# Altium schematic sheet Bluetooth and OLED Display.SchDoc
size A4
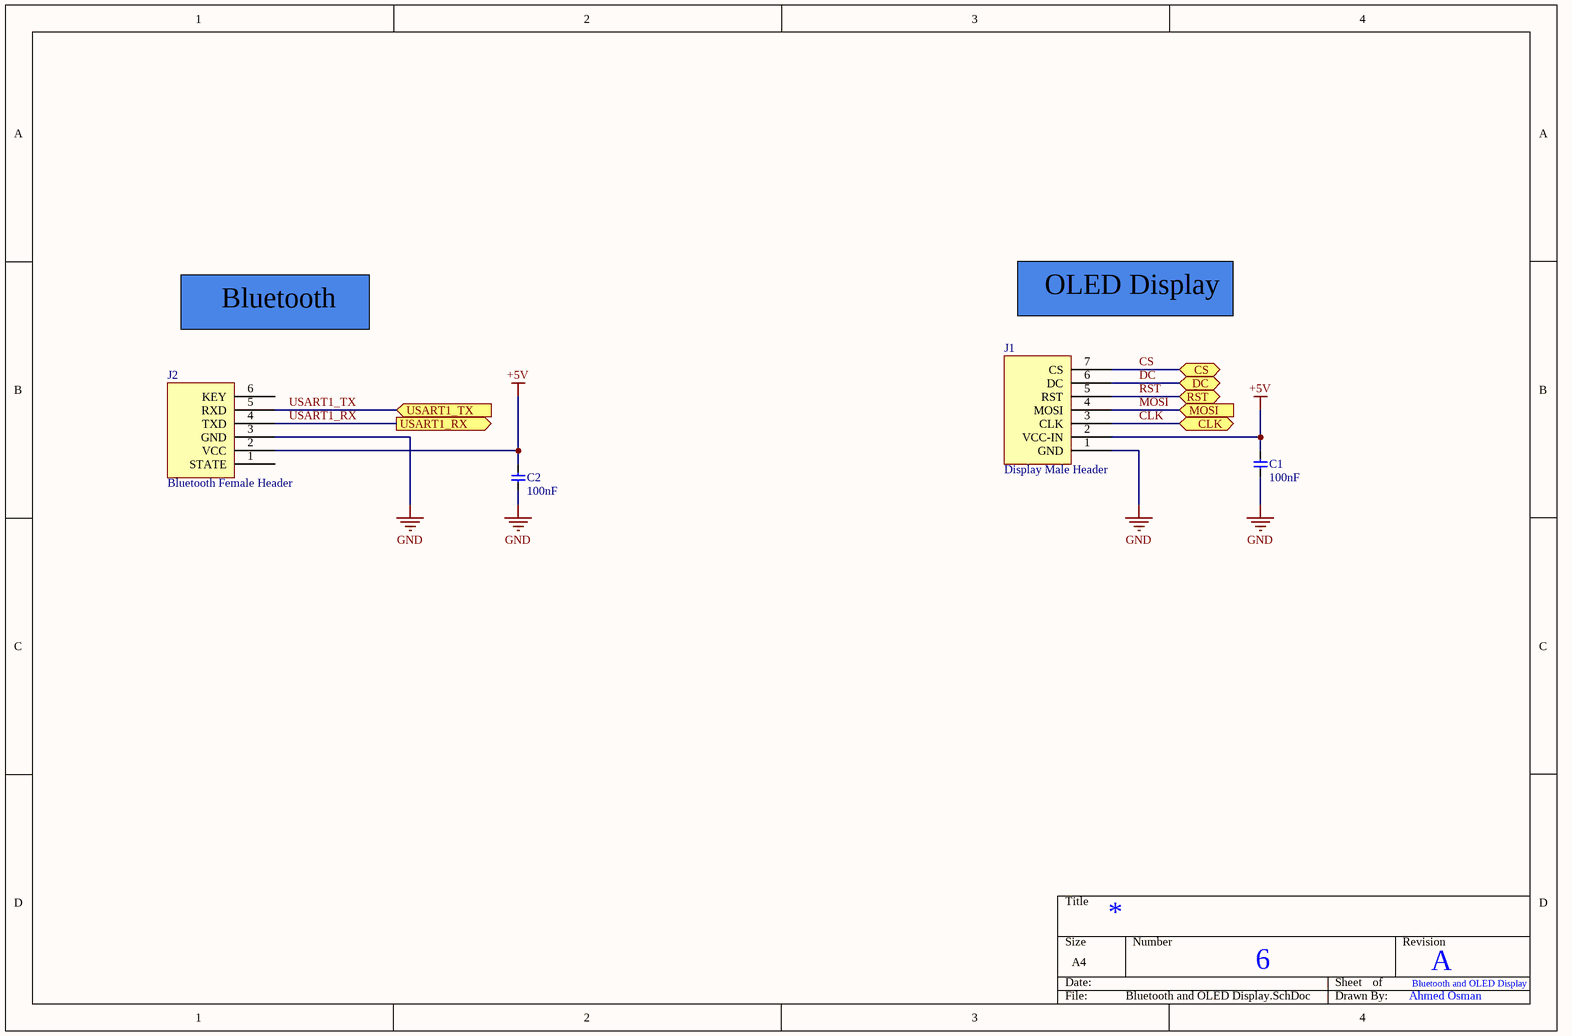
[diagram p0: Bluetooth and OLED Display.SchDoc]

## Parts
C1  100nF  [CAP 0603]
C2  100nF  [CAP 0603]
J1  Display Male Header  [OLED Display]
J2  Bluetooth Female Header  [HC-05 Bluetooth]

## Ports
CLK (bidir), CS (bidir), DC (bidir), MOSI (in), RST (bidir), USART1_RX (out), USART1_TX (in)

## Nets
+5V: C1.2 C2.1 J1.2(VCC-IN) J2.2(VCC)
GND: C1.1 C2.2 J1.1(GND) J2.3(GND)
CLK: J1.3(CLK) ; port CLK
CS: J1.7(CS) ; port CS
DC: J1.6(DC) ; port DC
MOSI: J1.4(MOSI) ; port MOSI
RST: J1.5(RST) ; port RST
USART1_RX: J2.4(TXD) ; port USART1_RX
USART1_TX: J2.5(RXD) ; port USART1_TX

Not connected (* = marked no-connect by the designer): J2 1(STATE) 6(KEY)

## Notes on the sheet
- Bluetooth
- OLED Display
- 6
- Bluetooth and OLED Display
- A
- Ahmed Osman

## Library data of the parts
C1 C2 = CAP  0603 100 nF 10% 50 V: 0.1 µF ±10% 50V Ceramic Capacitor X7R 0603 (1608 Metric); Manufacturer 1: Samsung; Manufacturer Part Number 1: CL10B104KB8NNNC; Supplier 1: Digikey; Stock 1: 6418947; Pricing 1: 4000 = 0.00562, 8000 = 0.00513, 12000 = 0.00489, 28000 = 0.00464, 100000 = 0.00336, 200000 = 0.00325, 400000 = 0.00306 (USD); RoHS: Yes; Mount: Surface Mount; Case/Package: 0603; Case Code (Metric): 1608; Case Code (Imperial): 0603; Material: Ceramic; Min Operating Temperature: -55°C; Max Operating Temperature: 125°C; Capacitance: 100nF; Tolerance: 10%; Dielectric: X7R; Voltage: 50V; Voltage Rating (DC): 50V; Voltage Rating: 50V; Package Quantity: 1; Packaging: Tape and Reel; Series: CL; Construction: Flat; Length: 1.6mm; Width: 0.031inch; Height: 0.8mm; Depth: 0.8mm; Thickness: 0.035inch; Radiation Hardening: No; Lead Free: Lead Free; RoHS Compliant: Yes; ComponentLink1URL: https://datasheet.ciiva.com/25803/cl10b104kb8nnnc-25803393.pdf?src-supplier=Digikey; ComponentLink1Description: https://datasheet.ciiva.com/25803/cl10b104kb8nnnc-25803393.pdf?src-supplier=Digikey; ComponentLink2URL: https://datasheet.ciiva.com/26838/getdatasheetpartid-89097-26838411.pdf?src-supplier=Verical; ComponentLink2Description: https://datasheet.ciiva.com/26838/getdatasheetpartid-89097-26838411.pdf?src-supplier=Verical; ComponentLink3URL: https://datasheet.ciiva.com/29198/456651-da-01-en-vs-kondensator-0605-29198839.pdf?src-supplier=Conrad; ComponentLink3Description: https://datasheet.ciiva.com/29198/456651-da-01-en-vs-kondensator-0605-29198839.pdf?src-supplier=Conrad; Supplier Part Number 1: 1276-1000-2-ND; value: 100nF; Manufacturer 2: Samsung; Manufacturer Part Number 2: CL10B104KB8NNNC; Supplier 2: LCSC; Supplier Part Number 2: C1591
J1 = Display connector: - Display: 0.95" Inch 7 Pin Colorful 65K SPI OLED Display Module SSD1331 9664 Resolution For 51 STM32 Arduino / - Connector: Direct Insert Policy 2.5mm 7P 6mm -40℃~+105℃ 3mm 2.54mm Single Row Black Brass 1x7P Plugin,P=2.54mm Pin Headers ROHS; Supplier 2: LCSC; Supplier Part Number 2: C492406; Manufacturer 2: XFCN; Manufacturer Part Number 2: PZ254V-11-07P
J2 = HC-05 Bluetooth Connector: Number of Positions: 6; Voltage Rating: 250V; Current Rating: 3A; Number of Contacts: 6NUMBER; Supplier 1: Digikey; Stock 1: 9721; Pricing 1: 1 = 0.47, 10 = 0.382, 80 = 0.31725, 440 = 0.27275, 1000 = 0.25359, 5000 = 0.2405 (USD); RoHS: Yes; Mount: Through Hole; Contact Material: Nickel,Gold; Housing Material: Plastic; Contact Finish - Mating: GOLD; Insulation Color: Black; Insulation Material: Polyester; Contact Shape: Square; Min Operating Temperature: -40°C; Max Operating Temperature: 105°C; Number of Rows: 1; Packaging: Tray; Termination: Solder; Connector Type: Header; Contact Type: Female Socket; Fastening Type: Pull; Series: -; Length: 15.7mm; Width: 2.5mm; Height: 8.7mm; Lead Free: Lead Free; RoHS Compliant: Yes; Flammability Rating: UL94 V-0; ComponentLink1URL: https://media.digikey.com/pdf/Data%20Sheets/Sullins%20PDFs/Female_Headers.100_DS.pdf?src-supplier=Digikey; ComponentLink1Description: https://media.digikey.com/pdf/Data%20Sheets/Sullins%20PDFs/Female_Headers.100_DS.pdf?src-supplier=Digikey; Supplier Part Number 1: S7039-ND; Manufacturer 2: Sullins; Manufacturer Part Number 2: PPPC061LFBN-RC; Supplier 2: LCSC; Supplier Part Number 2: C5845309